# EAGLE schematic StartingPoint (EAGLE 7.2.0)
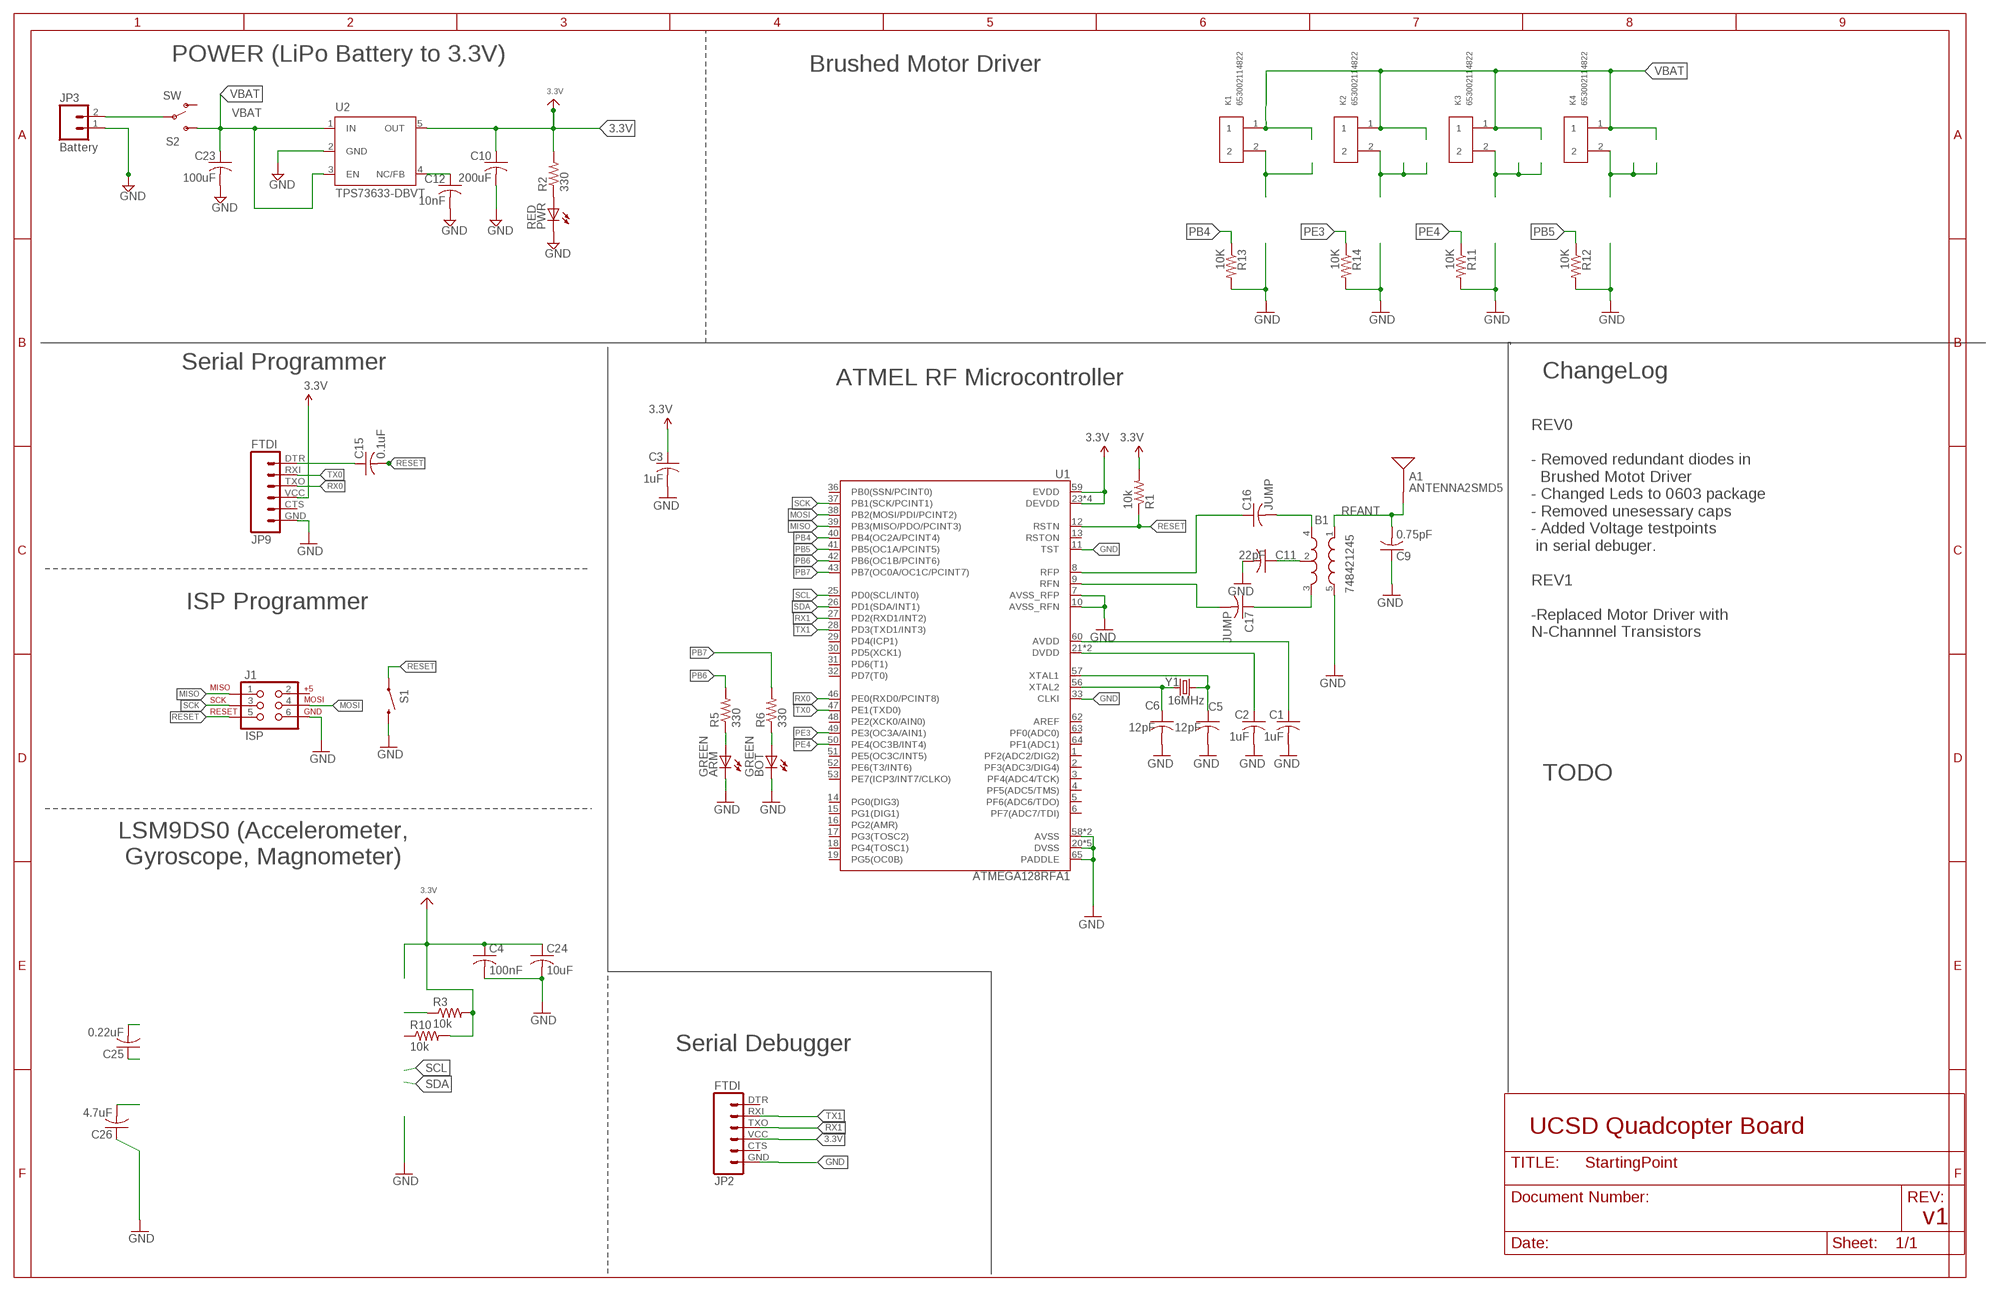
[diagram p0: schematic, sheet 1]

## Parts
A1  ANTENNA2SMD5  [ANTENNA-CHIP5]
ARM  GREEN  LEDCHIP-LED0805  [CHIP-LED0805]
B1  748421245  BALUN0805  [BALUN]
BOT  GREEN  LEDCHIP-LED0805  [CHIP-LED0805]
C1  1uF  C-USC0805  [C0805]
C2  1uF  C-USC0805  [C0805]
C3  1uF  C-USC0805  [C0805]
C4  100nF  C-USC0805  [C0805]
C5  12pF  C-USC0805  [C0805]
C6  12pF  C-USC0805  [C0805]
C9  0.75pF  C-USC0805  [C0805]
C10  200uF  C-USC0805  [C0805]
C11  22pF  C-USC0805  [C0805]
C12  10nF  C-USC0805  [C0805]
C15  0.1uF  C-USC0805  [C0805]
C16  JUMP  C-USC0805  [C0805]
C17  JUMP  C-USC0805  [C0805]
C23  100uF  C-USC0805  [C0805]
C24  10uF  C-USC0805  [C0805]
C25  0.22uF  C-USC0805  [C0805]
C26  4.7uF  C-USC0805  [C0805]
J1  ISP  AVR_SPI_PRG_6NS  [2X3-NS]
JP2  FTDI  FTDI_BASICPTH  [FTDI_BASIC]
JP3  Battery  M02PTH  [1X02]
JP9  FTDI  FTDI_BASICPTH  [FTDI_BASIC]
K1  653002114822  [653002114822]
K2  653002114822  [653002114822]
K3  653002114822  [653002114822]
K4  653002114822  [653002114822]
PWR  RED  LEDCHIP-LED0805  [CHIP-LED0805]
R1  10k  R-US_R0805  [R0805]
R2  330  R-US_R0805  [R0805]
R3  10k  R-US_R0805  [R0805]
R5  330  R-US_R0805  [R0805]
R6  330  R-US_R0805  [R0805]
R10  10k  R-US_R0805  [R0805]
R11  10K  R-US_R0805  [R0805]
R12  10K  R-US_R0805  [R0805]
R13  10K  R-US_R0805  [R0805]
R14  10K  R-US_R0805  [R0805]
S1  SWITCH-MOMENTARY-2SMD  [TACTILE_SWITCH_SMD]
S2  SW  SWITCH-SPDTPTH  [SWITCH-SPDT]
U1  ATMEGA128RFA1  [QFN-64]
U2  TPS73633-DBVT  [SOT23-DBV]
Y1  16MHz  CRYSTAL5X3  [CRYSTAL-SMD-5X3]

## Nets
3.3V: C3.1 C4.1 C10.1 C24.1 JP2.VCC JP9.VCC R1.2 R2.2 R3.2 R10.2 U1.23(DEVDD) U1.34(DEVDD) U1.44(DEVDD) U1.54(DEVDD) U1.59(EVDD) U2.5(OUT)
AVDD: C1.1 U1.60(AVDD)
DTR: C15.1 JP9.DTR
DVDD: C2.1 U1.21(DVDD) U1.22(DVDD)
GND: ARM.C B1.5(GND) BOT.C C1.2 C2.2 C3.2 C4.2 C5.2 C6.2 C9.1 C10.2 C11.2 C12.2 C23.2 C24.2 C26.1 J1.6 JP2.GND JP3.1 JP9.GND PWR.C R11.2 R12.2 R13.2 R14.2 S1.3 U1.7(AVSS_RFP) U1.10(AVSS_RFN) U1.11(TST) U1.20(DVSS) U1.24(DVSS) U1.33(CLKI) U1.35(DVSS) U1.45(DVSS) U1.55(DVSS) U1.58(AVSS) U1.61(AVSS) U1.65(PADDLE) U2.2(GND)
MISO: J1.1 U1.39(PB3(MISO/PDO/PCINT3))
MOSI: J1.4 U1.38(PB2(MOSI/PDI/PCINT2))
N$1: C12.1 U2.4(NC/FB)
N$2: PWR.A R2.1
N$3: C5.1 U1.57(XTAL1) Y1.3
N$4: C6.1 U1.56(XTAL2) Y1.1
N$7: B1.2(GND) C11.1
N$8: ARM.A R5.1
N$10: B1.4(OUT1) C16.2
N$11: B1.3(OUT2) C17.1
N$13: BOT.A R6.1
N$15: JP3.2 S2.2(P)
N$20: C26.2
N$21: C25.2
N$22: C25.1
N$23: R3.1
N$29: K1.2
N$30: K2.2
N$31: K3.2
N$32: K4.2
PB4: R13.1 U1.40(PB4(OC2A/PCINT4))
PB5: R12.1 U1.41(PB5(OC1A/PCINT5))
PB6: R5.2 U1.42(PB6(OC1B/PCINT6))
PB7: R6.2 U1.43(PB7(OC0A/OC1C/PCINT7))
PE3: R14.1 U1.49(PE3(OC3A/AIN1))
PE4: R11.1 U1.50(PE4(OC3B/INT4))
RESET: C15.2 J1.5 R1.1 S1.1 U1.12(RSTN)
RFANT [RFSIG]: A1.FEED(SIGNAL) B1.1(IN) C9.2
RFN: C17.2 U1.9(RFN)
RFP: C16.1 U1.8(RFP)
RX0: JP9.TXO U1.46(PE0(RXD0/PCINT8))
RX1: JP2.TXO U1.27(PD2(RXD1/INT2))
SCK: J1.3 U1.37(PB1(SCK/PCINT1))
SCL: U1.25(PD0(SCL/INT0))
SDA: U1.26(PD1(SDA/INT1))
TX0: JP9.RXI U1.47(PE1(TXD0))
TX1: JP2.RXI U1.28(PD3(TXD1/INT3))
VBAT: C23.1 K1.1 K2.1 K3.1 K4.1 S2.3(S) U2.1(IN) U2.3(EN)
Unconnected: J1.2 JP2.CTS JP2.DTR JP9.CTS R10.1 S2.1(O) U1.1(PF2(ADC2/DIG2)) U1.2(PF3(ADC3/DIG4)) U1.3(PF4(ADC4/TCK)) U1.4(PF5(ADC5/TMS)) U1.5(PF6(ADC6/TDO)) U1.6(PF7(ADC7/TDI)) U1.13(RSTON) U1.14(PG0(DIG3)) U1.15(PG1(DIG1)) U1.16(PG2(AMR)) U1.17(PG3(TOSC2)) U1.18(PG4(TOSC1)) U1.19(PG5(OC0B)) U1.29(PD4(ICP1)) U1.30(PD5(XCK1)) U1.31(PD6(T1)) U1.32(PD7(T0)) U1.36(PB0(SSN/PCINT0)) U1.48(PE2(XCK0/AIN0)) U1.51(PE5(OC3C/INT5)) U1.52(PE6(T3/INT6)) U1.53(PE7(ICP3/INT7/CLKO)) U1.62(AREF) U1.63(PF0(ADC0)) U1.64(PF1(ADC1))

## Notes on the sheet
- POWER (LiPo Battery to 3.3V)
- Brushed Motor Driver
- Serial Programmer
- ATMEL RF Microcontroller | ChangeLog
- ISP Programmer
- REV0
  
  - Removed redundant diodes in 
    Brushed Motot Driver
  - Changed Leds to 0603 package
  - Removed unesessary caps
  - Added Voltage testpoints
   in serial debuger.
  
  REV1
  
  -Replaced Motor Driver with 
  N-Channnel Transistors
- TODO
- LSM9DS0 (Accelerometer,
   Gyroscope, Magnometer)
- Serial Debugger
- UCSD Quadcopter Board
- v1

## Library data of the parts
A1 = SparkFun-RF:ANTENNA2: Chip antenna Single endded antenna. Common with smaller chip antennas. CHIP4 package is the GPS Chip Antenna SKU: GPS-08418. CHIP5 package is 2.4GHz chip antenna SKU: WRL-00144.
ARM BOT PWR = led:LED: LED OSRAM: - CHIPLED LG R971, LG N971, LY N971, LG Q971, LY Q971, LO R971, LY R971 LH N974, LH R974 LS Q976, LO Q976, LY Q976 LO Q996 - Hyper CHIPLED LW Q18S LB Q993, LB Q99A, LB R99A - SideLED LS A670, LO A670, LY A670, LG A670, LP A670 LB A673, LV A673, LT A673, LW A673 LH A674 LY A675 LS A676, LA A676, LO A676, LY A676, LW A676 LS A679, LY A679, LG A679 - Hyper Micro SIDELED® LS Y876, LA Y876, LO Y876, LY Y876 LT Y87S - SmartLED LW L88C, LW L88S LB L89C, LB L89S, LG L890 LS L89K, LO L89K, LY L89K LS L896, LA L896, LO L896, LY L896 - TOPLED LS T670, LO T670, LY T670, LG T670, LP T670 LSG T670, LSP T670, LSY T670, LOP T670, LYG T670 LG T671, LOG T671, LSG T671 LB T673, LV T673, LT T673, LW T673 LH T674 LS T676, LA T676, LO T676, LY T676, LB T676, LH T676, LSB T676, LW T676 LB T67C, LV T67C, LT T67C, LS T67K, LO T67K, LY T67K, LW E67C LS E67B, LA E67B, LO E67B, LY E67B, LB E67C, LV E67C, LT E67C LW T67C LS T679, LY T679, LG T679 LS T770, LO T770, LY T770, LG T770, LP T770 LB T773, LV T773, LT T773, LW T773 LH T774 LS E675, LA E675, LY E675, LS T675 LS T776, LA T776, LO T776, LY T776, LB T776 LHGB T686 LT T68C, LB T68C - Hyper Mini TOPLED® LB M676 - Mini TOPLED Santana® LG M470 LS M47K, LO M47K, LY M47K Source: http://www.osram.convergy.de LUXEON: - LUMILED® LXK2-PW12-R00, LXK2-PW12-S00, LXK2-PW14-U00, LXK2-PW14-V00 LXK2-PM12-R00, LXK2-PM12-S00, LXK2-PM14-U00 LXK2-PE12-Q00, LXK2-PE12-R00, LXK2-PE12-S00, LXK2-PE14-T00, LXK2-PE14-U00 LXK2-PB12-K00, LXK2-PB12-L00, LXK2-PB12-M00, LXK2-PB14-N00, LXK2-PB14-P00, LXK2-PB14-Q00 LXK2-PR12-L00, LXK2-PR12-M00, LXK2-PR14-Q00, LXK2-PR14-R00 LXK2-PD12-Q00, LXK2-PD12-R00, LXK2-PD12-S00 LXK2-PH12-R00, LXK2-PH12-S00 LXK2-PL12-P00, LXK2-PL12-Q00, LXK2-PL12-R00 Source: www.luxeon.com KINGBRIGHT: KA-3528ASYC Source: www.kingbright.com
B1 = SparkFun-RF:BALUN: 0805 footprint balun- Ember 351/357
C1-C3 C5 C6 C9-C12 C15-C17 C23 = resistor:C-US: CAPACITOR, American symbol
C4 C24-C26 = rcl:C-US: CAPACITOR, American symbol
J1 = Controller:AVR_SPI_PRG_6: AVR ISP 6 Pin This is the reduced ISP connector for AVR programming. Common on Arduino. This footprint will take up less PCB space and can be used with a 10-pin to 6-pin adapter such as SKU: BOB-08508
JP2 JP9 = SparkFun-Connectors:FTDI_BASIC: FTDI Basic header with labels
JP3 = SparkFun:M02: Header 2 Standard 2-pin 0.1" header. Use with straight break away headers (SKU : PRT-00116), right angle break away headers (PRT-00553), swiss pins (PRT-00743), machine pins (PRT-00117), and female headers (PRT-00115). Molex polarized connector foot print use with SKU : PRT-08233 with associated crimp pins and housings.
K1-K4 = Wuerth_Elektronik_eiCan_Wire_to_Board_Connectors:653002114822: WR-WTB 1.25mm Male Vertical Shrouded Header, 2 Pins=>Code : Con_WTB_1.25_PCB_THT_653002114822 <http://katalog.we-online.de/media/thumbs2/eican/thb_Con_WTB_1.25_PCB_THT_6530xx114822_pf2.jpg> Details see: http://katalog.we-online.de/en/em/653_0xx_114_822 Created 2014-06-06, Karrer Zheng 2014 (C) Würth Elektronik; OC_FARNELL: unknown
R1-R3 R5 R6 R10-R14 = resistor:R-US_: RESISTOR, American symbol
S1 = SparkFun-Electromechanical:SWITCH-MOMENTARY-2: Various NO switches- pushbuttons, reed, etc
S2 = Controller:SWITCH-SPDT: SPDT Switch Simple slide switch, Spark Fun Electronics SKU : COM-00102 DPDT SMT slide switch, AYZ0202, SWCH-08179; PROD_ID: SWCH-08261
U1 = Controller:ATMEGA128RFA1: ATmega128RFA1 8-bit AVR Microcontroller with Low Power 2.4GHz Transceiver for ZigBee and IEEE 802.15.4
U2 = Power:TPS73633-DBVT
Y1 = SparkFun-FreqCtrl:CRYSTAL: Various standard crystals. Proven footprints. Spark Fun Electronics SKU : COM-00534

## Net classes
1 RFSIG: width 0.457 mm, clearance 0.205 mm to class 0, clearance 0.205 mm